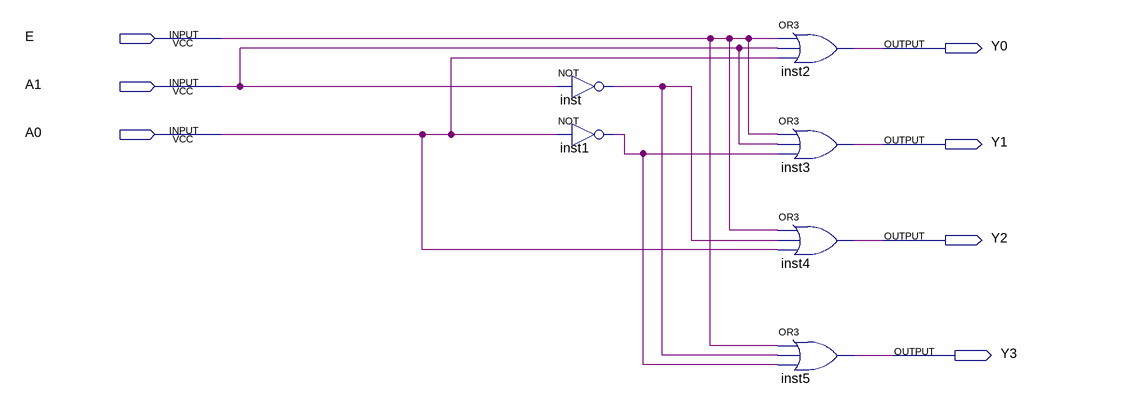
[diagram p0: schematic sheet]
// Quartus schematic Decoder.bdf as structural Verilog: 6 symbols, 7 pins
module Decoder (
  input  E,
  input  A1,
  input  A0,
  output Y0,
  output Y1,
  output Y2,
  output Y3
);

  wire inst1_out, inst_out;

  not inst (inst_out, A1);
  not inst1 (inst1_out, A0);
  or inst2 (Y0, E, A1, A0);
  or inst3 (Y1, E, A1, inst1_out);
  or inst4 (Y2, E, inst_out, A0);
  or inst5 (Y3, E, inst_out, inst1_out);
endmodule
